# EAGLE design 14140^8 (EAGLE 7.6.0)
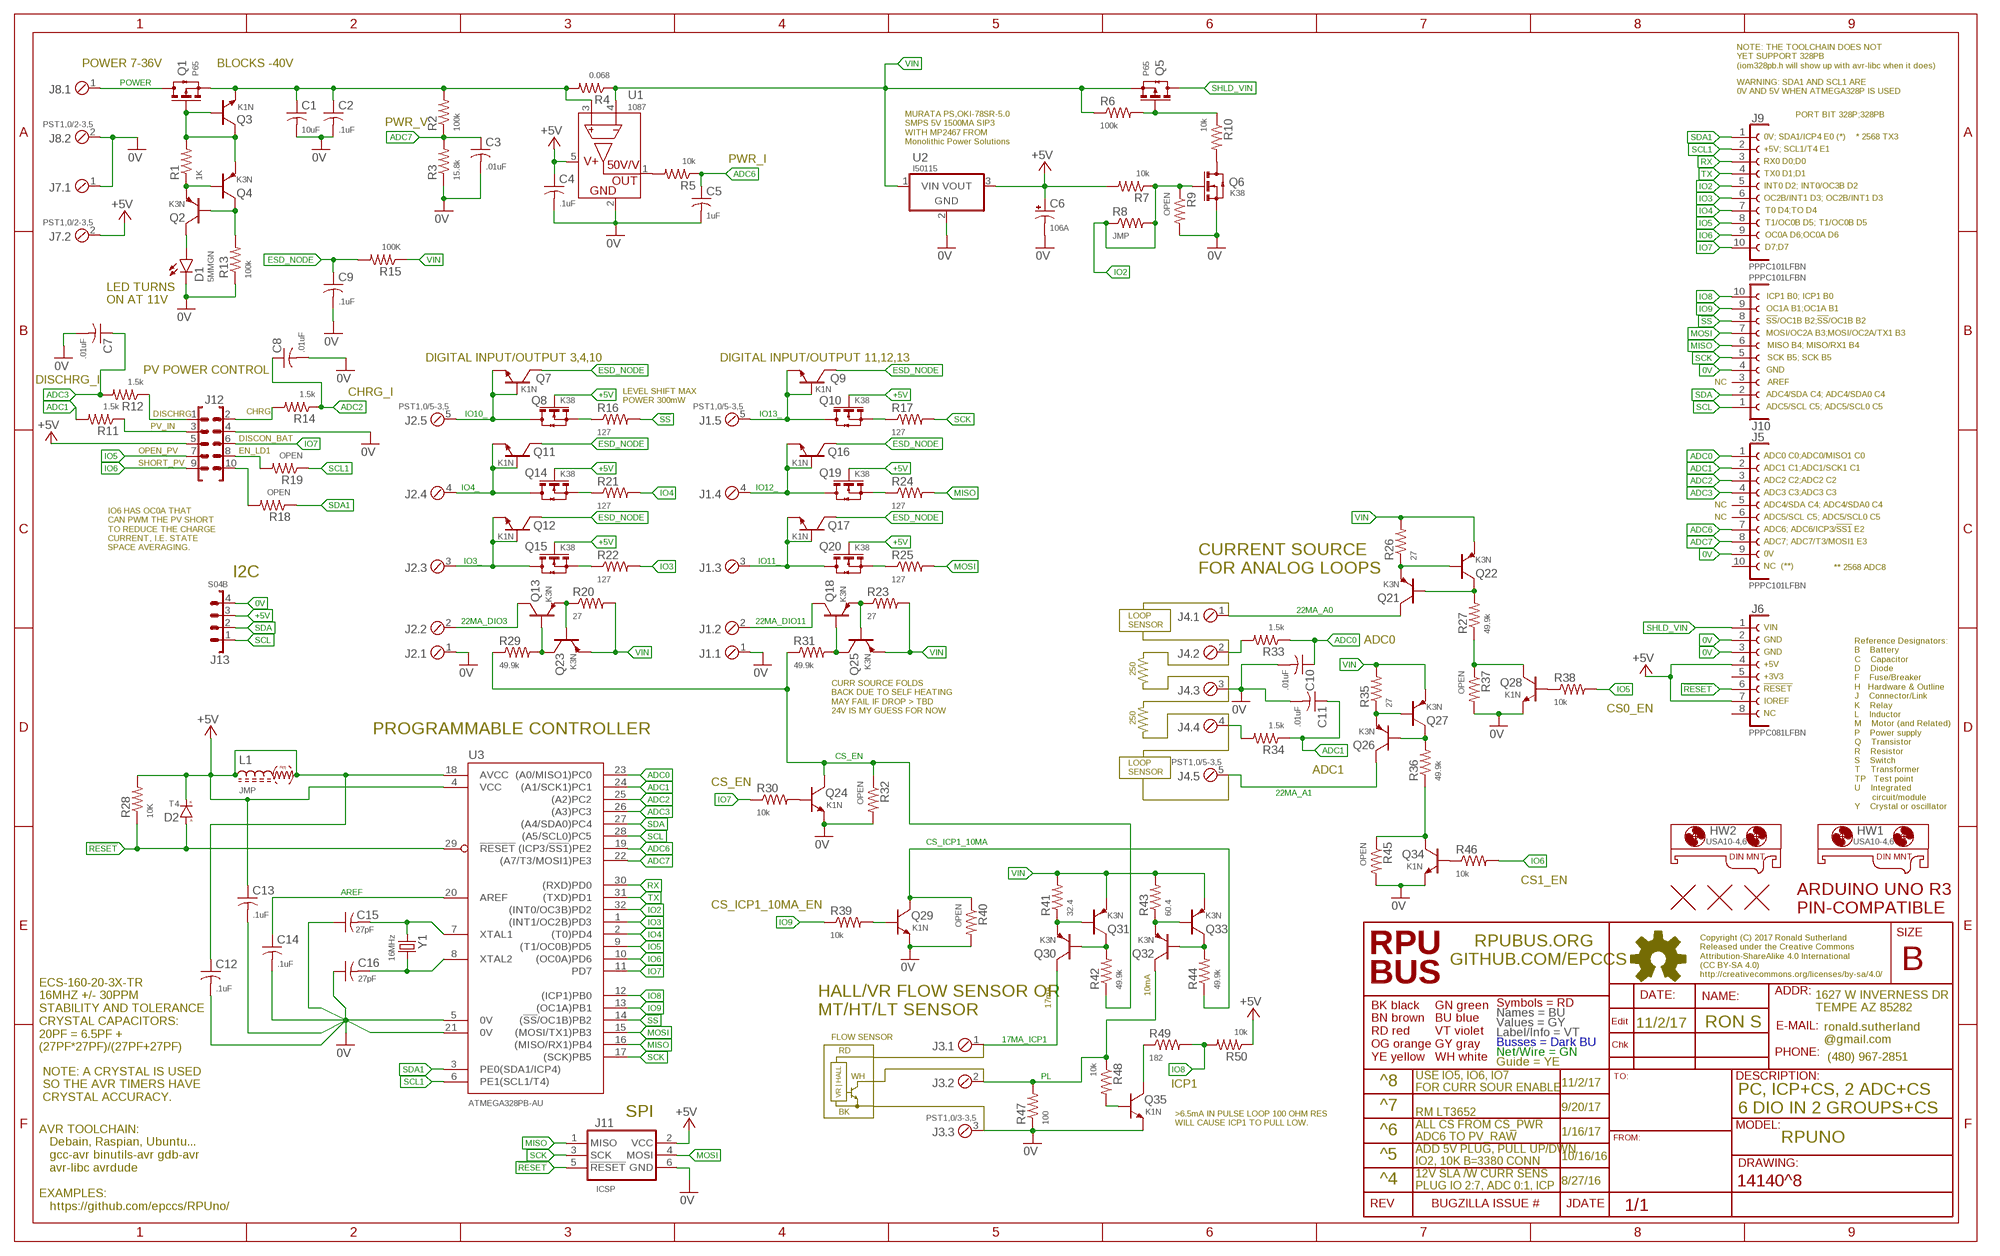
[diagram p0: schematic, sheet 1]

## Parts
C1  10uF  CC1206  [C1206(3216)]
C2  .1uF  CC0805A  [C0805(2012)]
C3  .01uF  CC0603A  [C0603(1608)]
C4  .1uF  CC0603A  [C0603(1608)]
C5  1uF  CC0805A  [C0805(2012)]
C6  106A  CT1206  [3216]
C7  .01uF  CC0603A  [C0603(1608)]
C8  .01uF  CC0603A  [C0603(1608)]
C9  .1uF  CC0603A  [C0603(1608)]
C10  .01uF  CC0603A  [C0603(1608)]
C11  .01uF  CC0603A  [C0603(1608)]
C12  .1uF  CC0603A  [C0603(1608)]
C13  .1uF  CC0603A  [C0603(1608)]
C14  .1uF  CC0603A  [C0603(1608)]
C15  27pF  CC0603A  [C0603(1608)]
C16  27pF  CC0603A  [C0603(1608)]
D1  5MMGN  LED5MM  [LED5MM]
D2  T4  DSOD123  [SOD123]
HW1  USA10-4,6  MOUNT-HOLE5.0  [USA10]
HW2  USA10-4,6  MOUNT-HOLE5.0  [USA10]
J1  PST1,0/5-3,5  MCV5  [MCV5]
J2  PST1,0/5-3,5  MCV5  [MCV5]
J3  PST1,0/3-3,5  MCV3  [MCV3]
J4  PST1,0/5-3,5  MCV5  [MCV5]
J5  PPPC101LFBN  F1X10  [F1X10]
J6  PPPC081LFBN  F1X8  [F1X8]
J7  PST1,0/2-3,5  MCV2  [MCV2]
J8  PST1,0/2-3,5  MCV2  [MCV2]
J9  PPPC101LFBN  F1X10  [F1X10]
J10  PPPC101LFBN  F1X10  [F1X10]
J11  ICSP  ISP-SPIPTH  [ISP]
J12  2X5  [2X5]
J13  S04B  B04B  [B04B]
L1  JMP  L0805  [C0805(2012)]
Q1  P65  N-CHSOT23  [SOT23]
Q2  K3N  PNPSOT23  [SOT23]
Q3  K1N  NPNSOT23  [SOT23]
Q4  K3N  PNPSOT23  [SOT23]
Q5  P65  N-CHSOT23  [SOT23]
Q6  K38  N-CHSOT23  [SOT23]
Q7  K1N  NPNSOT23  [SOT23]
Q8  K38  N-CHSOT23  [SOT23]
Q9  K1N  NPNSOT23  [SOT23]
Q10  K38  N-CHSOT23  [SOT23]
Q11  K1N  NPNSOT23  [SOT23]
Q12  K1N  NPNSOT23  [SOT23]
Q13  K3N  PNPSOT23  [SOT23]
Q14  K38  N-CHSOT23  [SOT23]
Q15  K38  N-CHSOT23  [SOT23]
Q16  K1N  NPNSOT23  [SOT23]
Q17  K1N  NPNSOT23  [SOT23]
Q18  K3N  PNPSOT23  [SOT23]
Q19  K38  N-CHSOT23  [SOT23]
Q20  K38  N-CHSOT23  [SOT23]
Q21  K3N  PNPSOT23  [SOT23]
Q22  K3N  PNPSOT23  [SOT23]
Q23  K3N  PNPSOT23  [SOT23]
Q24  K1N  NPNSOT23  [SOT23]
Q25  K3N  PNPSOT23  [SOT23]
Q26  K3N  PNPSOT23  [SOT23]
Q27  K3N  PNPSOT23  [SOT23]
Q28  K1N  NPNSOT23  [SOT23]
Q29  K1N  NPNSOT23  [SOT23]
Q30  K3N  PNPSOT23  [SOT23]
Q31  K3N  PNPSOT23  [SOT23]
Q32  K3N  PNPSOT23  [SOT23]
Q33  K3N  PNPSOT23  [SOT23]
Q34  K1N  NPNSOT23  [SOT23]
Q35  K1N  NPNSOT23  [SOT23]
R1  1K  R0805  [C0805(2012)]
R2  100k  R0805  [C0805(2012)]
R3  15.8k  R0805  [C0805(2012)]
R4  0.068  R1210  [C1210(3225)]
R5  10k  R0805  [C0805(2012)]
R6  100k  R0805  [C0805(2012)]
R7  10k  R0805  [C0805(2012)]
R8  JMP  R0805  [C0805(2012)]
R9  OPEN  R0805  [C0805(2012)]
R10  10k  R0805  [C0805(2012)]
R11  1.5k  R0805  [C0805(2012)]
R12  1.5k  R0805  [C0805(2012)]
R13  100k  R0805  [C0805(2012)]
R14  1.5k  R0805  [C0805(2012)]
R15  100K  R0805  [C0805(2012)]
R16  127  R0805  [C0805(2012)]
R17  127  R0805  [C0805(2012)]
R18  OPEN  R0805  [C0805(2012)]
R19  OPEN  R0805  [C0805(2012)]
R20  27  R0805  [C0805(2012)]
R21  127  R0805  [C0805(2012)]
R22  127  R0805  [C0805(2012)]
R23  27  R0805  [C0805(2012)]
R24  127  R0805  [C0805(2012)]
R25  127  R0805  [C0805(2012)]
R26  27  R0805  [C0805(2012)]
R27  49.9k  R0805  [C0805(2012)]
R28  10K  R0805  [C0805(2012)]
R29  49.9k  R0805  [C0805(2012)]
R30  10k  R0805  [C0805(2012)]
R31  49.9k  R0805  [C0805(2012)]
R32  OPEN  R0805  [C0805(2012)]
R33  1.5k  R0805  [C0805(2012)]
R34  1.5k  R0805  [C0805(2012)]
R35  27  R0805  [C0805(2012)]
R36  49.9k  R0805  [C0805(2012)]
R37  OPEN  R0805  [C0805(2012)]
R38  10k  R0805  [C0805(2012)]
R39  10k  R0805  [C0805(2012)]
R40  OPEN  R0805  [C0805(2012)]
R41  32.4  R0805  [C0805(2012)]
R42  49.9k  R0805  [C0805(2012)]
R43  60.4  R0805  [C0805(2012)]
R44  49.9k  R0805  [C0805(2012)]
R45  OPEN  R0805  [C0805(2012)]
R46  10k  R0805  [C0805(2012)]
R47  100  R0805  [C0805(2012)]
R48  10k  R0805  [C0805(2012)]
R49  182  R0805  [C0805(2012)]
R50  10k  R0805  [C0805(2012)]
U1  1087  ZXCT1087  [SOT23-5]
U2  I50115  OKI-78SR-H  [OKI-78SR-H]
U3  ATMEGA328PB-AU  [TQFP32-08]
U$1  ARDUINO-UNO  [ARDUINO_UNO]
U$2  FIDUCIAL1.27  [FIDUCIAL-1.27]
U$3  FIDUCIAL1.27  [FIDUCIAL-1.27]
U$4  FIDUCIAL1.27  [FIDUCIAL-1.27]
Y1  16MHz  CSM-3X  [CSM-3X]

## Nets
0V: C1.2 C2.2 C3.2 C4.2 C5.2 C6.- C7.2 C8.2 C9.2 C10.2 C11.2 C12.2 C13.2 C14.2 C15.1 C16.1 D1.K J1.1 J2.1 J3.3 J4.3 J5.9 J6.2 J6.3 J7.1 J8.2 J10.4 J11.6(GND) J12.4 J13.4 Q6.2(S)(S) Q24.E Q28.E Q29.E Q34.E Q35.E R3.1 R9.2 R13.1 R32.2 R37.2 R40.2 R45.2 R47.1 U1.2(GND) U2.2(GND) U3.5(0V) U3.21(0V)
17MA_ICP1: J3.1 Q30.C
22MA_A0: J4.1 Q21.C
22MA_A1: J4.5 Q26.C
22MA_DIO3: J2.2 Q13.C
22MA_DIO11: J1.2 Q18.C
!RESET!: D2.A J6.6 J11.5(!RESET) R28.1 U3.29(!RESET)
!SS: J10.8 R16.2 U3.14((!SS!/OC1B)PB2)
+5V: C4.1 C6.+ C12.1 C13.1 D2.C(K) J6.4 J6.7 J7.2 J11.2(VCC) J12.5 J13.3 L1.1 L1.2 Q8.1(G)(G) Q10.1(G)(G) Q14.1(G)(G) Q15.1(G)(G) Q19.1(G)(G) Q20.1(G)(G) R7.2 R28.2 R50.1 U1.5(VCC) U2.3(VOUT) U3.4(VCC) U3.18(AVCC)
ADC0: C10.1 J5.1 R33.1 U3.23((A0/MISO1)PC0)
ADC1: C11.1 J5.2 R11.2 R34.1 U3.24((A1/SCK1)PC1)
ADC2: C8.1 J5.3 R14.1 U3.25((A2)PC2)
ADC3: C7.1 J5.4 R12.2 U3.26((A3)PC3)
ADC6: C5.1 J5.7 R5.1 U3.19((ICP3/!SS1!)PE2)
ADC7: C3.1 J5.8 R2.1 R3.2 U3.22((A7/T3/MOSI1)PE3)
AREF: C14.1 U3.20(AREF)
CS_EN: Q24.C R29.1 R31.1 R32.1 R42.1
CS_ICP1_10MA: Q29.C R40.1 R44.1
EN_LD1: J12.8 R19.2
ESD_NODE: C9.1 Q7.C Q9.C Q11.C Q12.C Q16.C Q17.C R15.2
IO2: J9.5 Q6.1(G)(G) R7.1 R8.1 R8.2 R9.1 U3.32((INT0/OC3B)PD2)
IO3: J9.6 R22.2 U3.1((INT1/OC2B)PD3)
IO3_: J2.3 Q12.B Q12.E Q15.3(D)(D)
IO4: J9.7 R21.2 U3.2((T0)PD4)
IO4_: J2.4 Q11.B Q11.E Q14.3(D)(D)
IO5: J9.8 J12.7 R38.2 U3.9((T1/OC0B)PD5)
IO6: J9.9 J12.9 R46.2 U3.10((OC0A)PD6)
IO7: J9.10 J12.6 R30.1 U3.11(PD7)
IO8: J10.10 R49.2 R50.2 U3.12((ICP1)PB0)
IO9: J10.9 R39.1 U3.13((OC1A)PB1)
IO10_: J2.5 Q7.B Q7.E Q8.3(D)(D)
IO11_: J1.3 Q17.B Q17.E Q20.3(D)(D)
IO12_: J1.4 Q16.B Q16.E Q19.3(D)(D)
IO13_: J1.5 Q9.B Q9.E Q10.3(D)(D)
MISO: J10.6 J11.1(MISO) R24.2 U3.16((MISO/RX1)PB4)
MOSI: J10.7 J11.4(MOSI) R25.2 U3.15((MOSI/TX1)PB3)
N$1: Q19.2(S)(S) R24.1
N$2: Q5.1(G)(G) R6.2 R10.1
N$3: Q10.2(S)(S) R17.1
N$4: Q6.3(D)(D) R10.2
N$5: Q2.B Q4.C R13.2
N$6: Q1.1(G)(G) Q3.B Q3.C Q4.E R1.2
N$7: D1.A Q2.C
N$8: R5.2 U1.1(OUT)
N$9: Q18.E Q25.B R23.1
N$10: Q2.E Q4.B R1.1
N$11: Q18.B Q25.C R31.2
N$12: Q20.2(S)(S) R25.1
N$13: J12.10 R18.2
N$14: J12.2 R14.2
N$15: J12.1 R12.1
N$16: J12.3 R11.1
N$17: Q29.B R39.2
N$18: Q24.B R30.2
N$19: Q34.C R36.1 R45.1
N$20: Q21.E Q22.B R26.1
N$21: Q28.C R27.1 R37.1
N$22: Q28.B R38.1
N$23: Q21.B Q22.C R27.2
N$24: J4.2 R33.2
N$25: Q34.B R46.1
N$27: J4.4 R34.2
N$28: Q26.E Q27.B R35.1
N$29: Q26.B Q27.C R36.2
N$91: Q13.E Q23.B R20.1
N$93: Q14.2(S)(S) R21.1
N$97: Q13.B Q23.C R29.2
N$104: Q8.2(S)(S) R16.1
N$107: Q35.B R48.2
N$108: Q35.C R49.1
N$110: Q15.2(S)(S) R22.1
N$114: Q30.E Q31.B R41.1
N$115: C15.2 U3.7(XTAL1) Y1.1
N$116: C16.2 U3.8(XTAL2) Y1.2
N$119: Q30.B Q31.C R42.2
N$122: Q32.E Q33.B R43.1
N$123: Q32.B Q33.C R44.2
PL: J3.2 Q32.C R47.2 R48.1
POWER: J8.1 Q1.3(D)(D)
RX: J9.3 U3.30((RXD)PD0)
SCK: J10.5 J11.3(SCK) R17.2 U3.17((SCK)PB5)
SCL: J10.1 J13.1 U3.28((A5/SCL0)PC5)
SCL1: J9.2 R19.1 U3.6(PE1(SCL1/T4))
SDA: J10.2 J13.2 U3.27((A4/SDA0)PC4)
SDA1: J9.1 R18.1 U3.3(PE0(SDA1/ICP4))
SHLD_VIN: J6.1 Q5.3(D)(D)
TX: J9.4 U3.31((TXD)PD1)
VIN: Q5.2(S)(S) Q22.E Q23.E Q25.E Q27.E Q31.E Q33.E R4.1 R6.1 R15.1 R20.2 R23.2 R26.2 R35.2 R41.2 R43.2 U1.4(S-) U2.1(VIN)
VIN_S: C1.1 C2.1 Q1.2(S)(S) Q3.E R2.2 R4.2 U1.3(S+)
Unconnected: J5.5 J5.6 J5.10 J6.5 J6.8 J10.3

## Notes on the sheet
- POWER 7-36V | BLOCKS -40V
- NOTE: THE TOOLCHAIN DOES NOT 
  YET SUPPORT 328PB
  (iom328pb.h will show up with avr-libc when it does)
- WARNING: SDA1 AND SCL1 ARE 
  0V AND 5V WHEN ATMEGA328P IS USED
- PORT BIT 328P;328PB
- PWR_V
- 0V; SDA1/ICP4 E0 (*) | * 2568 TX3
- MURATA PS,OKI-78SR-5.0
  SMPS 5V 1500MA SIP3
  WITH MP2467 FROM 
  Monolithic Power Solutions
- +5V; SCL1/T4 E1
- PWR_I | RX0 D0;D0
- TX0 D1;D1
- INT0 D2; INT0/OC3B D2
- OC2B/INT1 D3; OC2B/INT1 D3
- T0 D4;TO D4
- T1/OC0B D5; T1/OC0B D5
- OC0A D6;OC0A D6
- D7;D7
- ICP1 B0; ICP1 B0
- LED TURNS 
  ON AT 11V
- OC1A B1;OC1A B1
- !SS!/OC1B B2;!SS!/OC1B B2
- MOSI/OC2A B3;MOSI/OC2A/TX1 B3
- MISO B4; MISO/RX1 B4
- DIGITAL INPUT/OUTPUT 3,4,10 | DIGITAL INPUT/OUTPUT 11,12,13 | SCK B5; SCK B5
- PV POWER CONTROL | GND
- DISCHRG_I | NC | AREF
- CHRG_I | ADC4/SDA C4; ADC4/SDA0 C4
- LEVEL SHIFT MAX 
  POWER 300mW
- ADC5/SCL C5; ADC5/SCL0 C5
- CHRG
- DISCHRG
- PV_IN
- DISCON_BAT
- OPEN_PV | EN_LD1
- ADC0 C0;ADC0/MISO1 C0
- SHORT_PV
- ADC1 C1;ADC1/SCK1 C1
- ADC2 C2;ADC2 C2
- ADC3 C3;ADC3 C3
- NC | ADC4/SDA C4; ADC4/SDA0 C4
- NC | ADC5/SCL C5; ADC5/SCL0 C5
- ADC6; ADC6/ICP3/!SS1! E2
- ADC7; ADC7/T3/MOSI1 E3
- IO6 HAS OC0A THAT 
  CAN PWM THE PV SHORT 
  TO REDUCE THE CHARGE 
  CURRENT, I.E. STATE 
  SPACE AVERAGING.
- 0V
- NC  (**) | ** 2568 ADC8
- CURRENT SOURCE
  FOR ANALOG LOOPS
- I2C
- LOOP 
  SENSOR
- VIN
- ADC0 | GND
- GND
- +5V
- 250
- +3V3
- !RESET
- IOREF
- CS0_EN
- CURR SOURCE FOLDS 
  BACK DUE TO SELF HEATING 
  MAY FAIL IF DROP > TBD 
  24V IS MY GUESS FOR NOW
- NC
- 250
- PROGRAMMABLE CONTROLLER
- ADC1
- LOOP 
  SENSOR
- CS_EN
- CS1_EN
- CS_ICP1_10MA_EN
- 10mA
- 17mA
- HALL/VR FLOW SENSOR OR
  MT/HT/LT SENSOR
- 11/2/17 | RON S
- FLOW SENSOR
- ECS-160-20-3X-TR
  16MHZ +/- 30PPM
  STABILITY AND TOLERANCE
  CRYSTAL CAPACITORS:
  20PF = 6.5PF +
  (27PF*27PF)/(27PF+27PF)
- RD
- WH
- ICP1 | ^8 | 11/2/17
- USE IO5, IO6, IO7
  FOR CURR SOUR ENABLE
- VR | HALL
- NOTE: A CRYSTAL IS USED 
  SO THE AVR TIMERS HAVE 
  CRYSTAL ACCURACY.
- ^7 | 9/20/17
- PC, ICP+CS, 2 ADC+CS
  6 DIO IN 2 GROUPS+CS
- SPI | BK | RM LT3652
- >6.5mA IN PULSE LOOP 100 OHM RES
  WILL CAUSE ICP1 TO PULL LOW.
- ^6 | 1/16/17
- ALL CS FROM CS_PWR
  ADC6 TO PV_RAW
- RPUNO
- ^5 | 10/16/16
- ADD 5V PLUG, PULL UP/DWN 
  IO2, 10K B=3380 CONN
- ^4 | 8/27/16
- 12V SLA /W CURR SENS
  PLUG IO 2:7, ADC 0:1, ICP
- AVR TOOLCHAIN: 
     Debain, Raspian, Ubuntu...
     gcc-avr binutils-avr gdb-avr 
     avr-libc avrdude
  
  EXAMPLES:
     https://github.com/epccs/RPUno/

## Library data of the parts
C1-C5 C7-C16 = C-C:C: CAPACITOR Symbol
C6 = C-T:CT: Tantalum Electrolytic Capacitor
D1 = D-LED:LED: LED 120120WH [CREE,XHGAWT-00-0000-00000HXE1] LED WHITE 6500K 150LUM-W120120
D2 = D-GP:D: DIODE
HW1 HW2 = HW-DINMnt:MOUNT-HOLE: USA10-4.6 [PhxCont,1202713] DINRAIL ADAPTER UNIVERSAL 10MM 4.6MM
J1 J2 J4 = J-HDR3.5mm:MCV5: MCV 1,5/5-G-3,5-RN [PHOENIX CONTACT,1843635] CONN HEADER SHROUDED 5POS 3.5MM MCVR 1,5/5-ST-3,5 [PHOENIX CONTACT,1863181] CONN PLUG 5POS SCREW 3.5MM PST 1,0/5-3,5 [PHOENIX CONTACT,1945122] CONN HEADER STRIP PIN 5POS 3.5MM PT 1,5/5-PVH-3,5 [PHOENIX CONTACT,1984044] CONN PLUG STRIP 4POS 3.5MM Drill Size 3/64": .0469" (1.2mm)
J3 = J-HDR3.5mm:MCV3: MCV 1,5/ 3-G-3,5-RN [PHOENIX CONTACT,1731484] CONN HEADER SHROUDED 3POS 3.5MM MCVR 1,5/ 3-ST-3,5 [PHOENIX CONTACT,1863165] CONN PLUG 3POS SCREW 3.5MM PST 1,0/3-3,5 [PHOENIX CONTACT,1945106] CONN HEADER STRIP PIN 3POS 3.5MM PT1,5&3-PVH-3,5 [PHOENIX CONTACT,1984028] CONN PLUG STRIP 3POS 3.5MM
J5 J9 J10 = J-HDR2.54mm:F1X10: FEMALE HEADER 10POS
J6 = J-HDR2.54mm:F1X8: FEMALE HEADER 8POS
J7 J8 = J-HDR3.5mm:MCV2: MCV 1,5/ 2-G-3,5-RN [PHOENIX CONTACT,1731471] CONN HEADER SHROUDED 2POS 3.5MM MCVR 1,5/ 2-ST-3,5 [PHOENIX CONTACT,1863152] CONN PLUG 2POS SCREW 3.5MM PST 1,0/2-3,5 [PHOENIX CONTACT,1945096] CONN HEADER STRIP PIN 2POS 3.5MM PT1,5/2-PVH-3,5 [PHOENIX CONTACT,1984015] CONN PLUG STRIP 2POS 3.5MM
J11 = U-AVR:ISP-SPI: AVR ISP thru SPI In-System Programming uses the target Atmel AVR’s internal SPI (Serial Peripheral Interface) to download code into the flash and EEPROM memories. It is not a debugging interface. When designing an application PCB which includes an AVR with the SPI interface, this pinout should be used. Sparkfun SKU: BOB-08508
J12 = J-HDR2.54mm:2X5: 2 X 5 POS HEADER
J13 = J-HDR2mm:B04B: B04B [JST@B04B-PASK] CONN HEADER VERT THRU 4POS S04B [JST@S04B-PASK] CONN HEADER SIDE THRU 4POS
L1 = L-FB:L: Ferrite Bead with frequency dependent resistance
Q1 Q5 = Q-PCH:N-CH?*: ENHANCEMENT MODE MOSFET SOT23 is BSS138 pinout
Q2 Q4 Q13 Q18 Q21-Q23 Q25-Q27 Q30-Q33 = Q-PNP:PNP: BJT NPN General Purpose Amplifier
Q3 Q7 Q9 Q11 Q12 Q16 Q17 Q24 Q28 Q29 Q34 Q35 = Q-NPN:NPN: BJT NPN General Purpose Amplifier
Q6 Q8 Q10 Q14 Q15 Q19 Q20 = Q-NCH:N-CH?*: ENHANCEMENT MODE MOSFET SOT23 is BSS138 pinout
R1-R50 = R-C:R: Resiistor American-style symbol
U1 = U-Linear:ZXCT1087: 1087 [DIODES,ZXCT1087E5TA] HISIDE CURRENT MONITOR SOT23-5
U2 = P-DCDC:OKI-78SR: OKI-78SR OKI-78SR-5/1.5-W36H-C 5V@1.5A Horizontal Mount OKI-78SR-5/1.5-W36-C 5V@1.5A Vert Mount OKI-78SR-3.3/1.5-W36H-C 3.3V@1.5A Horizontal Mount OKI-78SR-3.3/1.5-W36-C 3.3V@1.5A Vert Mount Murata Power Solutions 7 to 36 VDC input range need to verify pinout
U3 = U-AVR:ATMEGA328PB-AU: ATmega328PB 4 Kbytes FLASH 128 bytes SRAM 256 bytes EEPROM 2 UART, 2 I2C, 2 SPI 8-channel 10 bit ADC
U$1 = J-BoardHDR:ARDUINO-UNO: Board Outline with holes and silk note the board dim layer is not defined
U$2-U$4 = H-Fiducial:FIDUCIAL: Fiducial Alignment Points Various fiducial points for machine vision alignment.
Y1 = Y-XTL:CSM: 16MHZ20 [ECS,ECS-160-20-3X-TR] CRYSTAL 16MHZ 20PF 30PPM CSM-3X

## Net classes
0 default: width 0.178 mm, drill 0.33 mm

## Board
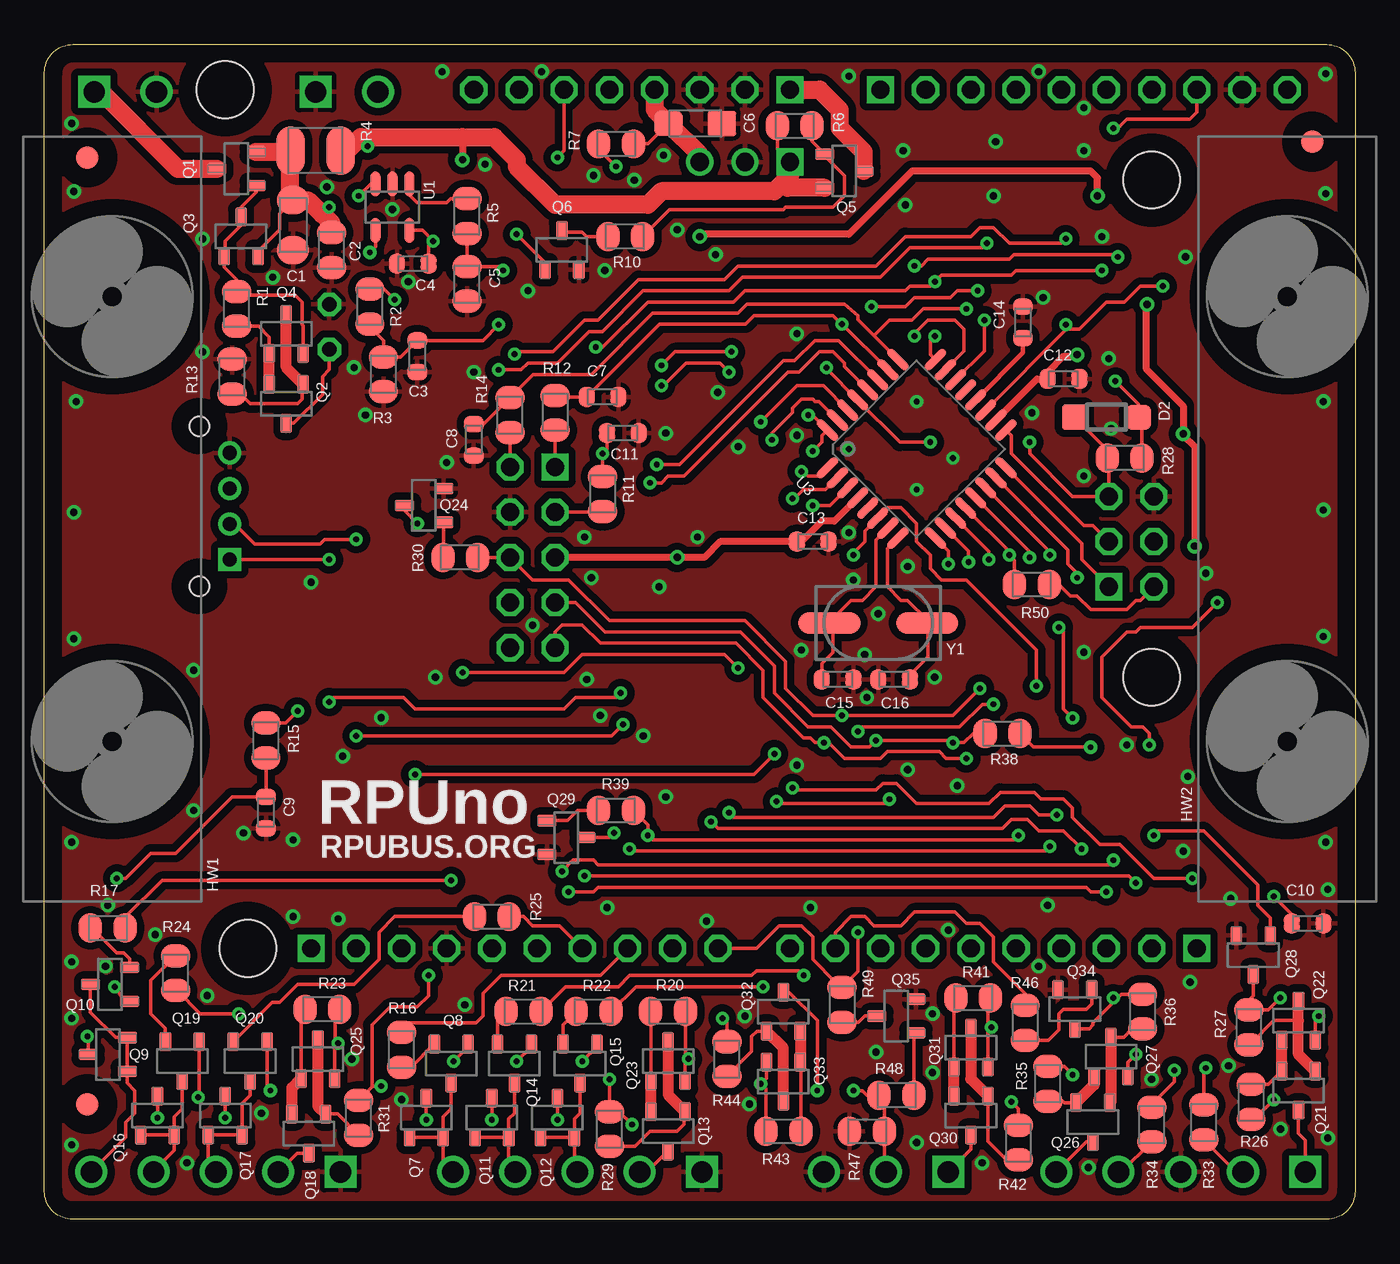
[diagram p1: board, top side]
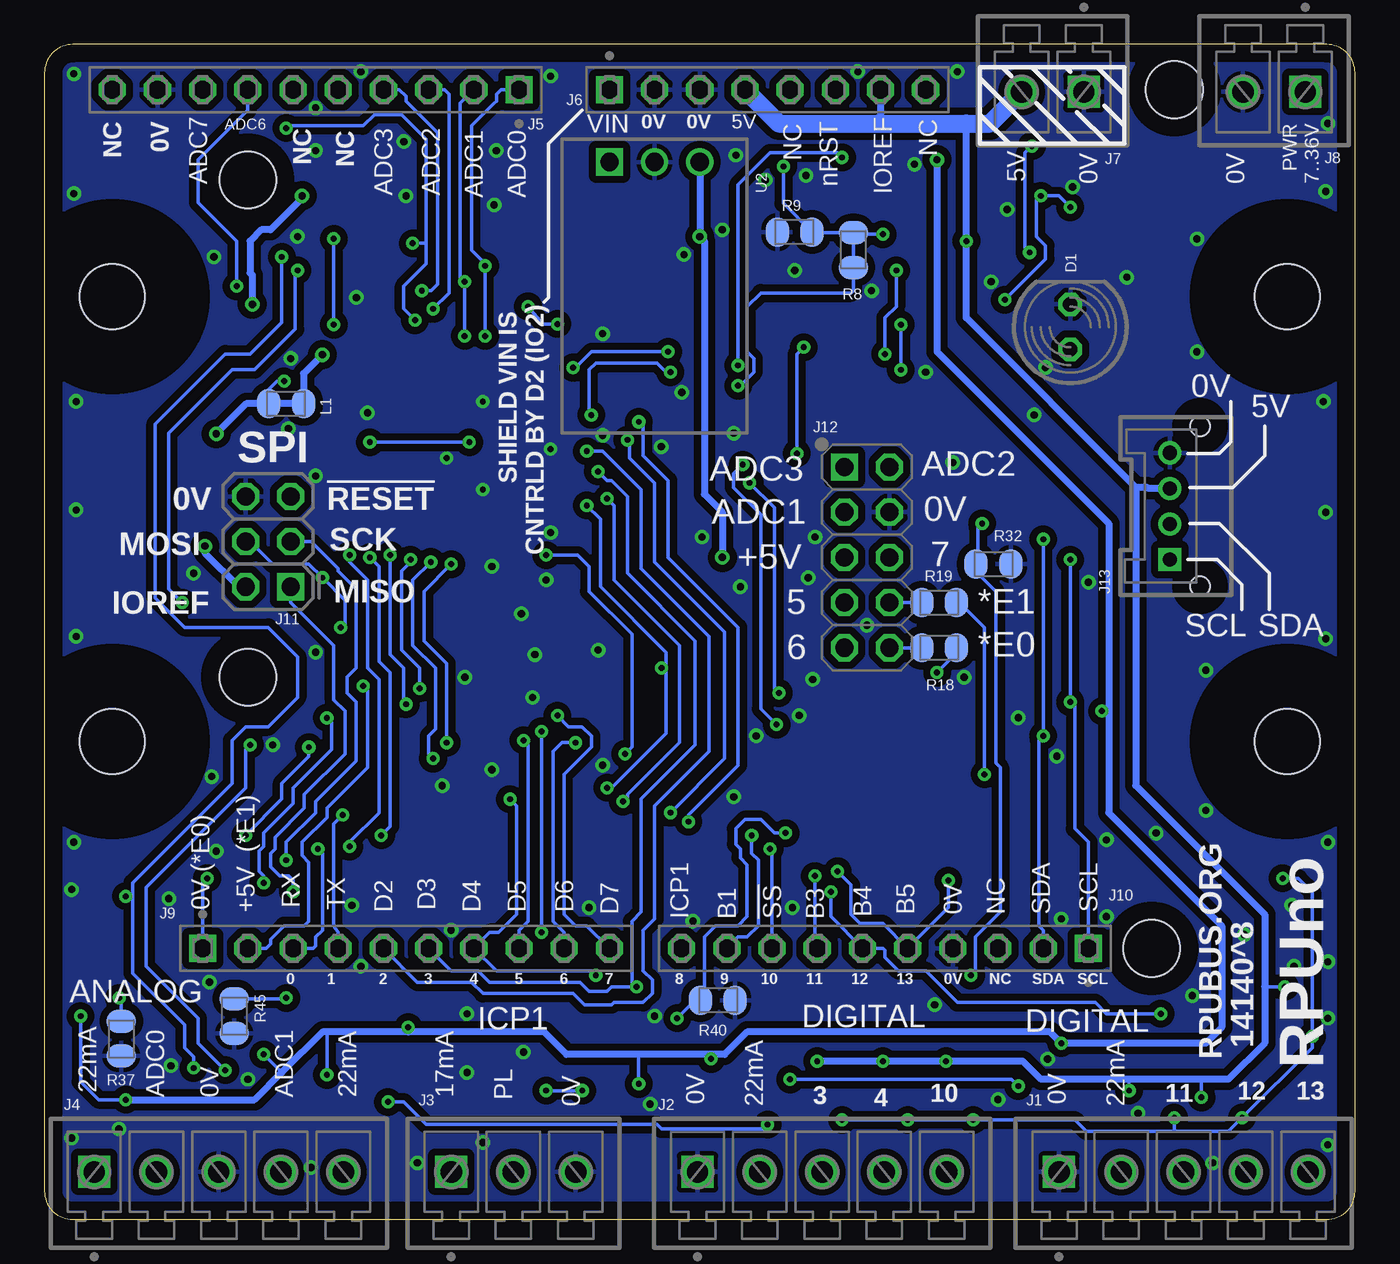
[diagram p2: board, bottom side, seen from below]

Size 73.66 x 66.04 mm. Coordinates in mm from the lower left corner, seen from the top.
Outline: 73.66,64.45 73.66,1.59 arc-90 72.07,0 1.59,0 arc-90 0,1.59 0,64.45 arc-90 1.59,66.04 72.07,66.04 arc-90 73.66,64.45
Copper layers (1*16): Top 0.034290625mm / dielectric 60mil / Bottom 0.034290625mm
Design rules "default *": minimum track width 7mil, minimum drill 13mil, track to track 12mil, track to pad 10mil, pad to pad 8mil, via to via 12mil, smd to smd 8mil, copper to edge 40mil, drill to drill 16mil, minimum pad ring 10mil, minimum via ring 8mil, stop-mask expansion 4mil, vias tented up to drill 17mil, thermal gap 10mil
Holes 3.2 mm at 10.16,63.5 11.43,15.24 62.23,30.48 62.23,58.42

### Footprints (pad centres in the part's own frame; a part is rotated, then mirrored left to right if it is on the bottom)
C1206(3216) = smd 1.6 x 1.8: 1 -1.4,0; 2 1.4,0
C0805(2012) = smd 1.321 x 1.651: 1 -0.977,0; 2 0.977,0
C0603(1608) = smd 0.898 x 1.1: 1 -0.889,0; 2 0.889,0
3216 = smd 1.6 x 1.4: + -1.5,0; - 1.5,0
LED5MM = drill 0.813 octagon: A -1.27,0; K 1.27,0
SOD123 = smd 1.4 x 1.4: A 1.8,0; C -1.8,0
USA10 = hole 3.658: -12.5,0; 12.5,0
MCV5 = drill 1.2 square: 1 0,0 | drill 1.2: 2 3.5,0; 3 7,0; 4 10.5,0; 5 14,0
MCV3 = drill 1.2 square: 1 0,0 | drill 1.2: 2 3.5,0; 3 7,0
F1X10 = drill 1.016 square: 1 0,0 | drill 1.016 octagon: 2 2.54,0; 3 5.08,0; 4 7.62,0; 5 10.16,0; 6 12.7,0; 7 15.24,0; 8 17.78,0; 9 20.32,0; 10 22.86,0
F1X8 = drill 1.016 square: 1 0,0 | drill 1.016 octagon: 2 2.54,0; 3 5.08,0; 4 7.62,0; 5 10.16,0; 6 12.7,0; 7 15.24,0; 8 17.78,0
MCV2 = drill 1.2 square: 1 0,0 | drill 1.2: 2 3.5,0
ISP = drill 1.016 square: 1 0,0 | drill 1.016 octagon: 2 0,2.54; 3 2.54,0; 4 2.54,2.54; 5 5.08,0; 6 5.08,2.54
2X5 = drill 1.016 square: 1 0,0 | drill 1.016 octagon: 2 0,2.54; 3 2.54,0; 4 2.54,2.54; 5 5.08,0; 6 5.08,2.54; 7 7.62,0; 8 7.62,2.54; 9 10.16,0; 10 10.16,2.54
B04B = drill 0.8 square: 1 0,0 | drill 0.8: 2 2,0; 3 4,0; 4 6,0 | hole 1.1: 7.5,-1.7; -1.5,-1.7
SOT23 = smd 0.65 x 1.06: 1(G) -0.95,-1.1; 2(S) 0.95,-1.1; 3(D) 0,1.1
SOT23' = smd 0.65 x 1.06: B -0.95,-1.1; C 0,1.1; E 0.95,-1.1
C1210(3225) = smd 1.6 x 2.7: 1 -1.4,0; 2 1.4,0
SOT23-5 = smd 0.55 x 1.4: 1 -0.95,-1.3; 2 0,-1.3; 3 0.95,-1.3; 4 0.95,1.3; 5 -0.95,1.3
OKI-78SR-H = drill 1.016 square: 1 0,0 | drill 1.016: 2 -2.54,0; 3 -5.08,0
TQFP32-08 = smd 1.5 x 0.45: 1 -4.293,2.8; 2 -4.293,2; 3 -4.293,1.2; 4 -4.293,0.4; 5 -4.293,-0.4; 6 -4.293,-1.2; 7 -4.293,-2; 8 -4.293,-2.8; 17 4.293,-2.8; 18 4.293,-2; 19 4.293,-1.2; 20 4.293,-0.4; 21 4.293,0.4; 22 4.293,1.2; 23 4.293,2; 24 4.293,2.8 | smd 0.45 x 1.5: 9 -2.8,-4.293; 10 -2,-4.293; 11 -1.2,-4.293; 12 -0.4,-4.293; 13 0.4,-4.293; 14 1.2,-4.293; 15 2,-4.293; 16 2.8,-4.293; 25 2.8,4.293; 26 2,4.293; 27 1.2,4.293; 28 0.4,4.293; 29 -0.4,4.293; 30 -1.2,4.293; 31 -2,4.293; 32 -2.8,4.293
FIDUCIAL-1.27 = smd 1.27 x 1.27: 1 0,0
CSM-3X = smd 3.5 x 1.2: 1 -2.75,0; 2 2.75,0

### Placement (x,y rotation side)
C1  13.97,55.88 270 top
C2  16.13,54.48 270 top
C3  20.95,48.51 270 top
C4  20.7,53.72 180 top
C5  23.75,52.58 270 top
C6  36.58,61.59 0 top
C7  31.37,46.23 0 top
C8  24.13,43.81 270 top
C9  12.45,22.86 270 top
C10  70.99,16.64 0 top
C11  32.51,44.2 0 top
C12  57.28,47.24 0 top
C13  43.18,38.1 0 top
C14  54.99,50.42 90 top
C15  44.58,30.35 180 top
C16  47.75,30.35 0 top
D1  16,50.16 90 bottom
D2  59.69,45.09 180 top
HW1  3.81,39.37 90 top
HW2  69.85,39.37 90 top
J1  16.64,2.67 0 bottom
J2  36.96,2.67 0 bottom
J3  50.8,2.67 0 bottom
J4  70.87,2.67 0 bottom
J5  46.99,63.5 180 bottom
J6  41.91,63.5 0 bottom
J7  15.24,63.37 180 bottom
J8  2.79,63.37 180 bottom
J9  64.77,15.24 0 bottom
J10  14.99,15.24 180 bottom
J11  59.82,35.56 90 bottom
J12  28.7,42.29 270 bottom
J13  10.41,37.08 90 bottom
L1  60.07,45.85 180 bottom
Q1  10.79,59.05 90 top
Q2  K3N  [SOT23']  13.59,45.85 180 top
Q3  K1N  [SOT23']  11.05,55.24 0 top
Q4  K3N  [SOT23']  13.59,49.78 0 top
Q5  44.96,58.93 270 top
Q6  29.08,54.48 0 top
Q7  K1N  [SOT23']  21.46,5.71 0 top
Q8  22.86,8.76 180 top
Q9  K1N  [SOT23']  3.56,9.27 90 top
Q10  3.68,13.21 90 top
Q11  K1N  [SOT23']  25.15,5.71 0 top
Q12  K1N  [SOT23']  28.83,5.71 0 top
Q13  K3N  [SOT23']  35.05,4.95 180 top
Q14  26.42,8.76 180 top
Q15  30.1,8.76 180 top
Q16  K1N  [SOT23']  6.35,5.84 0 top
Q17  K1N  [SOT23']  10.16,5.84 0 top
Q18  K3N  [SOT23']  14.86,4.83 180 top
Q19  7.75,8.89 180 top
Q20  11.56,8.89 180 top
Q21  K3N  [SOT23']  70.48,7.24 180 top
Q22  K3N  [SOT23']  70.48,11.18 0 top
Q23  K3N  [SOT23']  35.05,8.89 0 top
Q24  K1N  [SOT23']  21.34,40.13 90 top
Q25  K3N  [SOT23']  15.37,9.02 0 top
Q26  K3N  [SOT23']  58.93,5.46 180 top
Q27  K3N  [SOT23']  59.94,9.14 0 top
Q28  K1N  [SOT23']  67.94,14.86 180 top
Q29  K1N  [SOT23']  29.34,21.46 270 top
Q30  K3N  [SOT23']  52.07,5.84 180 top
Q31  K3N  [SOT23']  52.07,9.65 0 top
Q32  K3N  [SOT23']  41.53,11.68 0 top
Q33  K3N  [SOT23']  41.53,7.75 180 top
Q34  K1N  [SOT23']  57.91,11.81 180 top
Q35  K1N  [SOT23']  47.88,11.43 90 top
R1  10.79,51.18 90 top
R2  18.29,51.31 90 top
R3  19.05,47.5 90 top
R4  15.24,60.07 180 top
R5  23.75,56.39 90 top
R6  42.16,61.47 0 top
R7  32.13,60.45 0 top
R8  28.19,54.48 90 bottom
R9  31.5,55.5 180 bottom
R10  32.64,55.24 180 top
R11  31.37,40.77 90 top
R12  28.7,45.34 90 top
R13  10.54,47.37 270 top
R14  26.16,45.21 270 top
R15  12.45,26.92 270 top
R16  20.07,9.53 90 top
R17  3.56,16.38 0 top
R18  23.37,32.13 180 bottom
R19  23.37,34.67 180 bottom
R20  35.05,11.68 0 top
R21  26.92,11.68 0 top
R22  30.86,11.68 0 top
R23  15.62,11.81 0 top
R24  7.37,13.84 270 top
R25  25.15,17.02 0 top
R26  67.82,6.6 270 top
R27  67.69,10.79 270 top
R28  60.71,42.8 0 top
R29  31.75,5.08 270 top
R30  23.37,37.21 180 top
R31  17.65,5.71 270 top
R32  20.32,36.83 0 bottom
R33  65.15,5.46 270 top
R34  62.23,5.33 270 top
R35  56.39,7.62 90 top
R36  61.72,11.68 270 top
R37  69.34,10.16 270 bottom
R38  53.85,27.3 180 top
R39  32.13,22.99 180 top
R40  35.81,12.32 0 bottom
R41  52.2,12.45 0 top
R42  54.74,4.32 270 top
R43  41.53,4.95 180 top
R44  38.35,9.02 270 top
R45  62.99,11.43 270 bottom
R46  55.12,11.05 90 top
R47  46.23,4.95 0 top
R48  47.88,6.99 0 top
R49  44.83,12.06 90 top
R50  55.5,35.69 180 top
U1  19.56,56.9 180 top
U2  41.91,59.44 180 bottom
U3  49.02,43.31 45 top
U$1  -3.81,66.04 180 bottom  (outside the outline)
U$2  71.25,60.58 0 top
U$3  2.41,59.69 0 top
U$4  2.41,6.48 0 top
Y1  46.86,33.53 0 top

### Tracks (layer width: path | path; a pad name or v marks a point on that pad's centre or on a via)
0V  (via drill 0.33, 0.41)
  other vias: 64.39,13.34 50.8,16.26 59.82,48.39 56.13,51.82 16.51,16.89 42.29,25.53 48.51,25.27 31.62,17.53 22.35,64.52 31.5,53.34 27.94,64.52 48.39,57.02 64.14,54.1 13.97,17.02 1.52,4.19 45.21,43.31 53.34,57.53 59.44,55.24 37.72,54.23 48.26,60.07 45.21,64.26 35.56,55.63 49.02,41.02 51.05,42.8 49.02,45.97 58.42,60.07 58.42,62.48 55.88,64.52 72.01,64.39 72.01,57.66 71.88,45.97 71.88,39.88 71.88,32.77 64.26,24.89 72.01,21.21 72.14,18.54 66.67,18.03 64.01,20.7 34.8,59.82 30.86,58.67 27.18,52.2 33.15,58.42 48.51,36.7 50.04,30.48 46.1,31.75 46.86,34.04 45.21,38.61 45.47,35.94 36.7,38.35 15.88,58.04 19.56,56.77 20.45,52.7 24.77,59.31 1.52,11.3 17.4,47.88 18.03,45.21 22.61,42.55 12.83,52.96 1.65,57.78 1.52,61.59 8.89,55.12 8.89,48.77 1.78,45.97 1.65,39.75 1.65,32.64 8.38,30.86 8.38,22.99 1.52,21.21 1.52,14.48 11.18,21.72 60.83,26.67 58.42,31.88 65.28,36.32 58.42,41.78 59.94,44.45 55.5,45.34 24.13,47.62 14.99,35.81 16.76,26.04 18.92,28.19 34.54,35.56 30.73,36.07 30.35,38.35 34.92,44.2 37.85,46.48 42.29,49.78 30.48,30.35 21.97,30.48 31.24,28.32 42.55,32 46.23,29.34 38.99,43.43 42.29,44.07 43.05,17.53 37.21,16.76 72.14,4.57 69.47,5.08 66.55,8.64 62.23,7.87 58.67,2.92 52.7,3.17 49.02,4.32 49.91,8.26 49.91,11.56 39.37,11.43 20.07,6.73 12.19,5.97 8,3.17 6.22,16 3.56,17.65 9.14,12.57 46.74,9.4 56.39,17.65 51.31,24.38 34.92,23.75 33.66,27.18 13.97,21.34 55.88,14.22 17.27,9.02 39.62,6.48 3.43,14.22 53.47,60.58 27.43,33.4 23.62,12.06
  pour Bottom (isolate 0.406): 0,66.04 73.66,66.04 73.66,0 0,0
  pour Top (isolate 0.406, rank 6): 0,66.04 73.66,66.04 73.66,0 0,0
17MA_ICP1
  Top 0.203: Q30.C 52.07,3.94 J3.1
22MA_A0
  Top 0.203: Q21.C 70.48,4.83 70.87,4.45 J4.1
22MA_A1
  Top 0.203: Q26.C 58.56,4.36 J4.5
22MA_DIO3
  Top 0.203: J2.2 33.87,2.67 Q13.C
22MA_DIO11
  Top 0.203: Q18.C 14.2,3.73 J1.2
!RESET!  (via drill 0.33)
  Top 0.203: 43.94,47.82 U3.29 48.08,43.69 v49.78,43.69 | v55.37,43.69 55.37,43.05 57.78,40.64 J11.5 59.82,42.84 R28.1 59.73,43.25 D2.A | v38.61,48.77 35.43,48.77 v34.67,48.01 | v28.83,59.69 29.21,60.07 J6.6
  Top 0.254: 43.94,47.82 v43.94,47.88
  Bottom 0.203: 43.81,47.88 42.93,48.77 v38.61,48.77 | v55.37,43.69 v49.78,43.69 | v34.67,48.01 34.67,58.17 32.89,59.94 29.08,59.94 v28.83,59.69
  Bottom 0.254: v43.94,47.88 43.81,47.88
!SS  (via drill 0.33)
  Top 0.203: U3.14 56.52,37.51 v56.52,37.34 | v56.52,20.95 56.26,20.7 33.02,20.7 v32.89,20.83 | J10.8 31.24,13.72 25.65,13.72 24.64,12.7 24.64,11.43 24.26,11.05 20.45,11.05 20.07,10.67 R16.2
  Bottom 0.203: v56.52,37.34 56.52,36.96 55.5,35.94 55.5,30.99 54.86,30.35 54.86,22.86 56.52,21.21 v56.52,20.95 | v32.89,20.83 32.77,20.7 J10.8
+5V  (via drill 0.33, 0.41)
  Top 0.203: R7.2 33.93,60.45 C6.+ | C4.1 21.59,54.74 v21.84,54.99 21.24,55.6 U1.5 | R50.1 57.02,35.69 57.66,35.05 58.04,35.05 58.8,34.29 60.83,34.29 61.34,34.8 61.59,34.8 J11.2 | R28.2 61.68,44.89 D2.C 61.49,45.83 v60.2,47.12 | Q15.1(G) 31.05,9.71 v30.23,8.89 | Q14.1(G) 27.37,9.71 v26.54,8.89 | Q8.1(G) 23.81,9.71 v22.99,8.89 | Q20.1(G) 12.51,7.43 v12.7,7.24 | Q19.1(G) 8.7,6.92 v8.64,6.86 | Q10.1(G) 4.51,12.26 v3.94,13.08
  Top 0.406: v59.18,57.53 59.18,58.55 58.8,58.93 48.77,58.93 45.21,55.37 36.96,55.37 v36.83,55.24 | U3.4 44.39,39.24 43.69,39.24 42.55,38.1 C13.1 37.97,38.1 37.08,37.21 v35.56,37.21 J12.5 | v64.64,37.85 64.64,43.43 64.01,44.07 v64.01,44.16 64.01,45.72 61.94,47.79 61.94,51.4 v61.98,51.44 | U3.18 55.79,47.24 C12.1 56.39,47.62 57.28,48.51 57.95,48.51 v58.04,48.6
  Top 1.016: U2.3 36.83,59.84 C6.+ 34.29,62.38 J6.4
  Bottom 0.203: v12.7,7.24 12.7,7.87 | v8.64,6.86 8.64,7.87 | v60.2,47.12 60.58,47.12 61.05,46.65 L1.2 | v3.94,13.08 5.08,13.08
  Bottom 0.406: v35.56,37.21 35.56,39.75 36.58,40.77 36.58,54.99 v36.83,55.24 U2.3 | v59.18,57.53 59.18,57.4 60.96,55.63 61.47,55.63 62.1,54.99 62.1,53.21 61.98,53.09 v61.98,51.44 | J6.7 26.67,61.72 26.8,61.59 | 21.84,61.59 v21.84,54.99 21.84,50.67 12.32,41.15 | 12.32,41.15 11.68,41.15 11.62,41.08 J13.3 | 12.32,41.15 12.32,24.38 5.08,17.14 5.08,13.08 5.08,9.91 7.11,7.87 8.64,7.87 12.7,7.87 17.65,7.87 18.67,8.89 v22.99,8.89 v26.54,8.89 v30.23,8.89 | v64.64,37.85 64.64,37.47 62.74,35.56 J11.2 | v64.01,44.16 62.32,45.85 L1.2 L1.1 59.09,47.55 v58.04,48.6
  Bottom 1.016: J6.4 32.38,61.59 26.8,61.59 21.84,61.59 20.52,61.59 J7.2
ADC0  (via drill 0.33)
  Top 0.203: U3.23 51.69,48.8 51.69,50.04 51.18,50.55 49.66,50.55 48.9,49.78 v48.9,49.66 | R33.1 65.15,8.38 v65.28,8.51 | v60.33,54.1 60.2,54.23 54.48,54.23 54.23,53.98 49.66,53.98 49.28,53.59 v48.9,53.59 | C10.1 70.1,17.14 v69.09,18.16
  Bottom 0.203: v48.9,49.66 v48.9,53.59 48.9,53.72 49.66,54.48 49.66,60.83 49.66,61.47 48.39,62.74 48.26,62.87 48.26,63.25 48.01,63.5 J5.1 | v65.28,8.51 65.28,9.14 65.79,9.65 65.79,10.92 68.71,13.84 68.71,18.16 | 68.71,18.16 68.71,18.92 63.12,24.51 63.12,26.92 62.36,27.69 61.09,27.69 59.44,29.34 59.44,31.62 61.09,33.27 65.79,33.27 67.44,34.92 67.44,44.7 63.5,48.64 62.1,48.64 60.33,50.42 v60.33,54.1 | v69.09,18.16 68.71,18.16
ADC1  (via drill 0.33)
  Top 0.203: U3.24 49.78,48.62 49.78,49.4 v50.04,49.66 | 62.23,6.48 63.5,7.75 v63.5,8.38 | v59.44,53.34 54.61,53.34 54.36,53.09 50.42,53.09 v50.04,52.7 49.78,52.45 48.64,52.45 48.39,52.2 39.37,52.2 38.73,51.56 33.91,51.56 31.37,49.02 v30.99,49.02 | R11.2 v31.37,43.05 31.62,43.31 C11.1 | v65.91,34.67 64.52,33.27 61.59,33.27 61.34,33.02 60.83,33.02 59.44,31.62 59.44,29.34 61.09,27.69 61.72,27.69 62.1,27.3 v62.1,26.67
  Top 0.254: R34.1 62.23,6.48
  Bottom 0.203: v50.04,49.66 v50.04,52.7 50.29,52.96 50.29,62.74 J5.2 | v63.5,8.38 65.02,9.91 65.02,11.3 67.94,14.22 67.94,18.67 62.36,24.26 62.36,26.42 v62.1,26.67 | v59.44,53.34 59.56,53.21 59.56,50.04 61.85,47.75 63.12,47.75 66.67,44.2 66.67,35.43 v65.91,34.67 | v31.37,43.05 31.37,48.64 v30.99,49.02
ADC2  (via drill 0.33)
  Top 0.203: U3.25 46.62,49.67 | 46.62,49.67 45.72,50.57 45.72,50.8 44.96,51.44 39.5,51.44 38.99,50.93 34.16,50.93 30.73,47.5 27.47,47.5 R14.1 | v51.82,51.18 49.4,51.18 48.77,50.55 47.5,50.55 46.62,49.67 | C8.1 24.68,44.7 R14.1 | 26.2,46.23 R14.1
  Bottom 0.203: v51.82,51.18 50.93,52.07 50.93,63.25 51.18,63.5 J5.3
ADC3  (via drill 0.33)
  Top 0.203: U3.26 v44.83,50.33 44.8,50.33 44.32,50.8 39.88,50.8 39.4,50.33 34.58,50.33 C7.1 28.79,46.23 R12.2 | v46.48,51.31 48.39,51.31 48.9,51.82 50.93,51.82 51.31,52.2 v52.45,52.2
  Bottom 0.203: v44.83,50.33 45.63,50.33 v46.48,51.31 | v52.45,52.2 51.94,52.2 51.56,52.58 51.56,61.09 53.34,62.87 53.34,63.12 53.72,63.5 J5.4
ADC6  (via drill 0.33)
  Top 0.203: U3.19 57.45,50.04 | 57.45,50.04 58.17,50.04 59.69,51.56 60.71,51.56 61.59,52.45 v62.87,52.45 | R5.1 C5.1 25.57,53.55 v25.78,53.34 | v26.42,48.64 26.54,48.77 28.57,48.77 30.35,50.55 31.11,50.55 33.4,52.83 38.23,52.83 38.99,53.59 46.74,53.59 48.39,55.24 52.07,55.24 52.58,55.75 53.34,55.75 54.23,54.86 57.15,54.86 v57.4,55.12 | 57.45,50.04 57.45,50.25 v57.4,50.29
  Bottom 0.203: v62.87,52.45 62.87,54.99 65.02,57.15 65.02,59.56 62.23,62.36 J5.7 | v25.78,53.34 25.78,51.31 26.42,50.67 v26.42,48.64 | v57.4,55.12 v57.4,50.29
ADC7  (via drill 0.33)
  Top 0.203: U3.22 52.83,48.81 v52.83,50.55 | v60.07,61.34 60.33,61.34 60.83,61.85 64.39,61.85 64.77,62.23 J5.8 | R2.1 18.29,50.16 19.05,49.4 R3.2 20.03,48.48 C3.1 24.64,49.4 v25.53,50.29 | v25.53,47.75 26.8,47.75 27.18,48.13 28.83,48.13 30.61,49.91 31.37,49.91 33.66,52.2 38.48,52.2 39.24,52.96 46.99,52.96 48.64,54.61 52.7,54.61 v52.96,54.86
  Bottom 0.203: v52.83,50.55 53.47,51.18 53.47,52.45 52.2,53.72 52.2,54.86 | 52.2,54.86 52.2,60.71 53.59,62.1 55.12,62.1 55.75,61.47 59.94,61.47 v60.07,61.34 | v25.53,50.29 v25.53,47.75 | v52.96,54.86 52.2,54.86
AREF
  Top 0.254: U3.20 54.99,48.71 C14.1
CS_EN  (via drill 0.33)
  Top 0.203: Q24.C 20.24,39.84 v20.95,39.12 | v21.59,13.72 21.59,12.57 20.95,11.94 19.43,11.94 18.41,10.92 18.41,7.49 | 18.41,7.49 18.41,7.45 R31.1 | v31.75,7.87 R29.1 32.3,6.06 v33.02,5.33 32.77,5.59 | v18.92,7.49 18.41,7.49 | R42.1 54.74,6.22 v54.36,6.6
  Bottom 0.203: v20.95,39.12 21.21,38.86 21.21,36.92 R32.1 21.3,36.41 20.19,35.31 20.19,25.65 19.94,25.4 19.94,17.27 21.34,15.88 21.34,13.97 v21.59,13.72 | v31.75,7.87 19.3,7.87 v18.92,7.49 | v54.36,6.6 53.47,6.6 52.2,5.33 39.24,5.33 38.99,5.08 33.27,5.08 v33.02,5.33
CS_ICP1_10MA  (via drill 0.33)
  Top 0.203: Q29.C 31.75,21.46 v32,21.72 | R44.1 38.35,11.05 v38.1,11.3
  Bottom 0.203: v32,21.72 32.64,21.72 33.4,22.48 34.29,22.48 34.8,21.97 34.8,21.08 34.54,20.83 34.54,20.32 34.16,19.94 34.16,17.02 34.67,16.51 35.94,16.51 36.58,15.88 36.58,12.53 R40.1 37.08,12.32 v38.1,11.3
EN_LD1
  Bottom 0.203: R19.2 J12.8
ESD_NODE  (via drill 0.33)
  Top 0.203: R15.2 C9.1 10.54,23.75 7.37,20.57 5.97,20.57 4.57,19.18 v4.06,19.18 | Q9.C 2.46,10.24 v2.41,10.29 | Q12.C v28.83,5.59 | Q16.C v6.35,5.71 | Q17.C v10.16,5.71 | Q7.C v21.46,5.59 | Q11.C v25.15,5.59
  Bottom 0.203: v4.06,19.18 3.17,19.18 2.41,18.41 v2.41,10.29 2.41,9.65 v6.35,5.71 7.11,4.95 10.16,4.95 | 10.16,4.95 15.11,4.95 15.75,5.59 v21.46,5.59 v25.15,5.59 v28.83,5.59 | v10.16,5.71 10.16,4.95
IO2  (via drill 0.33)
  Top 0.203: v43.18,43.18 43.69,43.69 43.69,44.04 U3.32 43.16,45.21 v42.93,45.21 | R7.1 31.15,60.16 v32.13,59.18 | Q6.1(G) 28.13,53.78 v26.54,55.37 | v38.48,47.62 37.97,48.13 36.07,48.13 34.8,46.86 v34.67,46.86
  Bottom 0.203: J9.5 52.7,13.34 49.66,13.34 49.02,12.7 43.94,12.7 43.31,12.06 41.78,12.06 41.66,12.19 40.01,12.19 39.5,12.7 39.5,13.46 40.01,13.97 40.01,16.26 39.37,16.89 39.37,23.24 36.32,26.29 36.32,32.77 40.13,36.58 40.13,41.02 42.29,43.18 v43.18,43.18 | v42.93,45.21 43.05,45.34 43.05,47.75 42.67,48.13 39.24,48.13 38.73,47.62 v38.48,47.62 | v32.13,59.18 32.13,57.11 R9.1 30.48,55.46 R8.2 | v26.54,55.37 28.11,55.37 R8.2 | v34.67,46.86 34.54,46.86 33.78,47.62 33.78,48.39 34.16,48.77 34.16,51.31 33.4,52.07 28.32,52.07 28.19,52.2 R8.1 R8.2
IO3  (via drill 0.33)
  Top 0.203: 43.98,42.25 43.51,41.78 42.93,41.78 42.67,42.04 v42.55,42.04 | v40.39,13.08 33.23,13.08 R22.2
  Top 0.254: U3.1 43.98,42.25
  Bottom 0.203: J9.6 50.8,13.97 49.28,13.97 48.64,13.34 43.56,13.34 43.05,12.83 42.04,12.83 41.78,13.08 v40.39,13.08 40.64,13.34 40.64,16.76 40.13,17.27 40.13,23.62 37.08,26.67 37.08,32.51 40.89,36.32 40.89,40.64 41.78,41.53 42.04,41.53 v42.55,42.04
IO3_
  Top 0.203: Q15.3(D) 30.1,5.97 29.78,5.65 Q12.E | Q12.B Q12.E | Q12.E 29.78,2.85 J2.3
IO4  (via drill 0.33)
  Top 0.203: U3.2 43.91,41.02 42.67,41.02 42.16,40.51 v42.04,40.51 | v41.15,23.5 41.27,23.37 47.24,23.37 v47.5,23.62 | v42.67,13.72 42.42,13.97 40.01,13.97 39.75,13.72 32.89,13.72 32.26,13.08 29.3,13.08 R21.2
  Bottom 0.203: v42.67,13.72 42.93,13.97 48.26,13.97 J9.7 48.64,16.13 48.13,16.13 47.12,17.14 47.12,23.24 v47.5,23.62 | v42.04,40.51 41.66,40.13 41.66,35.94 37.97,32.26 37.97,26.8 40.89,23.88 40.89,23.75 v41.15,23.5
IO4_
  Top 0.203: Q11.E 26.1,5.65 26.42,5.97 Q14.3(D) | Q11.B Q11.E | Q11.E 26.1,3.03 J2.4
IO5  (via drill 0.33)
  Top 0.203: U3.9 50.8,37.57 v50.8,36.83 | J12.7 29.84,34.67 31.5,33.02 39.12,33.02 41.02,31.11 41.02,29.59 42.93,27.69 44.2,27.69 45.34,26.54 46.35,26.54 v46.74,26.92 50.93,26.92 v51.05,26.8 51.69,26.8 52.2,27.3 R38.2
  Bottom 0.203: v50.8,36.83 52.32,35.31 52.32,32.51 51.05,31.24 v51.05,26.8 | J9.8 46.99,16.26 46.48,16.76 46.48,26.67 v46.74,26.92
IO6  (via drill 0.33)
  Top 0.203: U3.10 51.94,37.56 v51.94,36.96 | v51.82,25.91 50.67,25.91 50.29,26.29 47.37,26.29 46.99,25.91 44.96,25.91 44.07,26.8 v43.81,26.8 43.31,26.8 43.05,27.05 42.67,27.05 40.39,29.34 40.39,30.86 38.86,32.38 31.24,32.38 30.23,33.4 29.08,33.4 28.7,33.02 J12.9 | R46.2 55.12,12.7 53.34,14.48 53.34,15.88 52.58,16.64 51.82,16.64 51.18,17.27 48.9,17.27 48.13,16.51 46.61,16.51 46.1,17.02 45.34,17.02 44.45,16.13 J9.9
  Bottom 0.203: J9.9 44.45,16.13 45.09,16.76 45.09,26.29 44.58,26.8 v43.81,26.8 | v51.94,36.96 52.96,35.94 52.96,32.26 51.69,30.99 51.69,27.56 52.07,27.18 52.07,26.16 v51.82,25.91
IO7  (via drill 0.33)
  Top 0.203: U3.11 53.09,37.55 v53.09,37.08 | v52.58,29.84 51.05,28.32 v44.83,28.32 43.18,28.32 41.66,29.84 41.66,31.37 39.37,33.66 31.75,33.66 29.46,35.94 27.43,35.94 J12.6 R30.1
  Bottom 0.203: 53.09,36.96 53.59,36.45 53.59,32 52.58,30.99 v52.58,29.84 | J9.10 43.18,16.51 43.81,16.51 44.45,17.14 44.45,25.02 42.93,26.54 42.93,27.18 43.43,27.69 44.2,27.69 v44.83,28.32
  Bottom 0.254: v53.09,37.08 53.09,36.96
IO8  (via drill 0.33)
  Top 0.203: J10.10 40.01,15.24 41.27,16.51 42.55,16.51 43.18,15.88 43.18,14.61 44.45,13.34 | v53.34,28.96 52.7,28.96 51.44,27.69 45.97,27.69 v45.72,27.43 | v45.72,16.13 45.72,13.93 R49.2 | U3.12 54.23,37.53 v54.23,37.34 54.52,37.05 R50.2
  Top 0.254: 44.45,13.34 44.54,13.34 R49.2
  Bottom 0.203: v45.72,27.43 v45.72,16.13 | v54.23,37.34 54.23,31.75 53.47,30.99 53.47,29.08 v53.34,28.96
IO9  (via drill 0.33)
  Top 0.203: U3.13 55.37,37.52 v55.37,37.21 | v54.74,21.59 54.48,21.34 34.16,21.34 v33.91,21.59 33.91,22.19 R39.1
  Bottom 0.203: v55.37,37.21 54.86,36.7 54.86,31.37 54.23,30.73 54.23,22.1 v54.74,21.59 | J10.9 34.67,15.88 34.16,15.88 33.53,16.51 33.53,20.19 33.91,20.57 v33.91,21.59
IO10_
  Top 0.203: Q8.3(D) 22.86,6.22 22.41,5.78 Q7.E | Q7.B Q7.E | Q7.E 22.41,3.21 J2.5
IO11_
  Top 0.203: J1.3 9.21,3.09 Q17.B Q17.E 11.11,6.54 11.56,6.99 Q20.3(D)
IO12_
  Top 0.203: Q19.3(D) 7.75,6.22 7.3,5.78 Q16.E | Q16.E Q16.B | J1.4 6.14,2.71 7.3,3.87 Q16.E
IO13_
  Top 0.203: Q10.3(D) 2.58,11.64 4,10.22 Q9.E Q9.B 4.66,7.66 5.08,7.24 5.08,5.97 4.57,5.46 4.57,4.6 J1.5
MISO  (via drill 0.33)
  Top 0.203: U3.16 58.29,38 58.29,37.08 J11.1 | v29.46,18.41 30.86,18.41 31.11,18.67 58.55,18.67 58.8,18.41 v59.69,18.41 | R24.2 7.45,12.87 8.76,11.56 v10.92,11.56
  Bottom 0.203: v29.46,18.41 29.46,17.02 J10.6 26.54,15.24 26.42,15.11 26.42,14.73 25.65,13.97 24.13,13.97 22.35,12.19 14.61,12.19 13.97,11.56 v10.92,11.56 | v59.69,18.41 59.69,19.05 59.94,19.3 60.45,19.3 60.96,19.81 60.96,20.57 60.71,20.83 60.71,21.46 59.05,23.11 59.05,23.88 56.77,26.16 56.77,28.57 57.4,29.21 57.4,32.26 59.82,34.67 J11.1
MOSI  (via drill 0.33)
  Top 0.203: U3.15 57.53,37.63 57.53,36.83 58.04,36.32 v58.04,36.07 | v61.34,18.92 60.96,19.3 v30.35,19.3 | v57.02,33.27 57.28,33.02 57.28,28.7 v57.78,28.19 | J10.7 28.96,16.51 27.43,16.51 26.92,17.02 R25.2
  Bottom 0.203: v30.35,19.3 30.35,15.37 J10.7 | J11.4 62.1,38.1 60.83,36.83 58.8,36.83 v58.04,36.07 56.77,34.8 56.77,33.4 v57.02,33.27 | v61.34,18.92 61.34,19.3 61.59,19.56 61.59,20.7 61.34,20.95 61.34,21.72 59.69,23.37 59.69,24.26 57.53,26.42 57.53,27.94 v57.78,28.19
N$1
  Top 0.203: Q19.2(S) 6.8,10.73 5.97,11.56 5.97,13.42 R24.1
N$2
  Top 0.203: R6.2 43.14,60.59 Q5.1(G) 43.86,59.77 44.96,58.67 44.96,57.53 44.32,56.9 41.66,56.9 41.53,56.77 35.14,56.77 R10.1
N$3
  Top 0.203: R17.1 2.69,16.38 2.69,16.36 4.06,14.99 4.45,14.99 4.78,14.65 Q10.2(S)
N$4
  Top 0.203: R10.2 30.48,55.24 30.23,55.5 29.17,55.5 Q6.3(D)
N$5
  Top 0.203: R13.2 11.01,46.39 11.56,45.85 14.22,45.85 14.48,46.1 14.48,46.89 Q2.B
  Top 0.61: Q2.B 14.52,46.95 13.59,47.88 Q4.C
N$6
  Top 0.203: Q4.E 14.54,50.23 14.48,50.29 14.48,51.56 14.1,51.94 11.01,51.94 R1.2 10.79,52.83 10.1,53.53 Q3.B 10.16,54.21 10.16,54.99 11.05,55.88 Q3.C 11.05,56.9 11.89,57.74 Q1.1(G)
N$7
  Top 0.203: Q2.C 14.01,44.75 15.62,46.35 15.62,47.37 16,47.75 D1.A
N$8
  Top 0.203: R5.2 22.82,57.37 22.61,57.15 20.95,57.15 20.51,57.6 U1.1
N$9
  Top 0.203: Q25.B 14.42,11.78 R23.1
  Top 0.61: Q18.E 13.91,7.41 Q25.B
N$10
  Top 0.203: R1.1 12.03,50.2 12.64,49.59 Q4.B
  Top 0.61: Q2.E Q4.B
N$11
  Top 0.203: Q18.B 16.46,5.93 R31.2
  Top 0.61: Q25.C 15.37,6.37 Q18.B
N$12
  Top 0.203: Q20.2(S) 12.81,12.19 13.21,12.19 14.22,13.21 17.4,13.21 18.8,14.61 18.8,16.13 19.68,17.02 R25.1
N$13
  Bottom 0.203: R18.2 J12.10
N$14
  Top 0.203: J12.2 R14.2
N$15
  Top 0.203: J12.1 R12.1
N$16
  Top 0.203: J12.3 31.33,39.75 R11.1
N$17
  Top 0.203: R39.2 29.97,22.99 29.4,22.41 Q29.B
N$18
  Top 0.203: Q24.B 22.44,37.26 R30.2
N$19  (via drill 0.33)
  Top 0.203: Q34.C 58.72,10.71 58.93,10.92 58.93,11.05 60.2,12.32 | 60.2,12.32 60.54,12.66 R36.1 | v60.07,12.45 60.2,12.32
  Bottom 0.203: R45.1 60.11,12.41 v60.07,12.45
N$20
  Top 0.203: R26.1 68.78,7.58 Q21.E
  Top 0.61: Q21.E Q22.B
N$21  (via drill 0.33)
  Top 0.203: v69.47,12.45 68.8,11.77 R27.1 67.69,12.32 67.94,12.57 Q28.C
  Bottom 0.203: R37.1 69.34,12.32 v69.47,12.45
N$22  (via drill 0.33)
  Top 0.203: Q28.B 68.89,16.96 68.2,17.65 68.2,18.8 65.15,21.84 62.61,21.84 v62.36,21.59 | v58.8,26.54 55.59,26.54 R38.1
  Bottom 0.203: v62.36,21.59 60.33,23.62 60.33,24.51 58.8,26.04 v58.8,26.54
N$23
  Top 0.203: R27.2 67.82,9.91 69.09,11.18 70.48,11.18
  Top 0.254: 71.37,8.4 Q21.B 71.44,8.32
  Top 0.61: 71.44,8.32 70.48,9.27 70.48,11.18 Q22.C
N$24
  Top 0.203: J4.2 66.97,2.67 R33.2
N$25
  Top 0.203: R46.1 56.43,10.07 57.02,10.67 57.02,11.56 57.28,11.81 58.55,11.81 58.86,12.13 Q34.B
N$27
  Top 0.203: J4.4 60.54,2.67 R34.2
N$28
  Top 0.203: R35.1 57.24,6.64 57.32,6.56 Q26.E
  Top 0.61: Q26.E 58.04,6.6 58.99,7.56 Q27.B
N$29
  Top 0.203: R36.2 61.13,10.71 60.66,10.24 Q27.C
  Top 0.61: Q27.C 59.94,6.62 Q26.B
N$91
  Top 0.203: Q23.B 34.1,11.66 R20.1
  Top 0.61: Q13.E Q23.B
N$93
  Top 0.203: Q14.2(S) 25.47,11.2 R21.1
N$97
  Top 0.203: Q13.B 35.94,5.99 35.94,5.33 35.56,4.95 34.04,4.95 33.19,4.1 R29.2
  Top 0.61: Q23.C 35.05,7 Q13.B
N$104
  Top 0.203: R16.1 20.59,8.55 Q8.2(S)
N$107
  Top 0.203: R48.2 48.86,10.36 Q35.B
N$108
  Top 0.203: R49.1 45.76,11.09 46.1,11.43 Q35.C
N$110
  Top 0.203: Q15.2(S) 29.15,10.95 R22.1
N$114
  Top 0.203: Q31.B 51.12,12.42
  Top 0.254: 51.12,12.42 R41.1
  Top 0.61: Q30.E Q31.B
N$115
  Top 0.203: U3.7 46.74,38.19 46.74,35.56 45.97,34.8 45.34,34.8 44.11,33.57 | C15.2 43.69,31.24 44.32,31.88 44.32,33.32 Y1.1
  Top 0.254: 44.11,33.57 Y1.1
N$116
  Top 0.203: 48.64,30.61 49.66,31.62 49.66,33.48 | 49.61,33.7 48.51,34.8 48.13,34.8 47.37,35.56 47.37,37.7 U3.8
  Top 0.254: C16.2 48.64,30.61 | 49.66,33.48 Y1.2 49.61,33.7
N$119
  Top 0.203: R42.2 54.06,3.34 53.02,4.38 Q30.B
  Top 0.61: Q31.C 52.07,7.89 Q30.B
N$122
  Top 0.203: R43.1 42.51,8.82 Q33.B
  Top 0.61: Q32.E Q33.B
N$123
  Top 0.203: Q32.B 40.05,10.58 39.75,10.29 39.75,9.44 R44.2
  Top 0.61: Q33.C 41.53,9.63 Q32.B
PL  (via drill 0.33)
  Top 0.203: J3.2 47.2,2.76 R47.2 47.2,6.3 R48.1 46.23,6.99 45.97,7.24 v45.47,7.24 | Q32.C 41.83,12.78 43.43,11.18 v43.43,7.24
  Bottom 0.203: v43.43,7.24 v45.47,7.24
POWER
  Top 1.016: J8.1 3.17,63.37 7.49,59.05 Q1.3(D)
RX  (via drill 0.33)
  Top 0.203: U3.30 43.77,46.86 42.29,46.86 v40.26,44.83 | v37.47,22.35 37.85,21.97 53.85,21.97 54.36,22.48 55.24,22.48 55.88,21.84 57.28,21.84 v58.29,20.83
  Bottom 0.203: v40.26,44.83 40.01,44.58 40.01,42.93 38.61,41.53 38.61,37.21 34.67,33.27 34.67,25.53 37.47,22.73 v37.47,22.35 | v58.29,20.83 58.04,20.57 58.04,16.26 58.42,15.88 58.42,15.37 58.55,15.24 J9.3
SCK  (via drill 0.33)
  Top 0.203: v60.07,20.19 59.82,19.94 31.11,19.94 30.86,20.19 29.72,20.19 v29.08,19.56 | U3.17 54.36,44.04 54.36,43.05 58.42,38.99 58.93,38.99 J11.3 | v22.86,19.05 6.6,19.05 4.57,17.02 R17.2
  Bottom 0.203: J11.3 58.67,38.1 57.15,36.58 57.15,36.45 56.13,35.43 56.13,30.99 56.64,30.48 56.64,29.59 56.13,29.08 56.13,25.78 58.42,23.5 58.42,22.86 60.07,21.21 v60.07,20.19 | v29.08,19.56 28.32,18.8 28.32,17.14 27.81,16.64 26.54,16.64 J10.5 22.86,17.53 v22.86,19.05
SCL  (via drill 0.33)
  Top 0.203: U3.28 44.96,47.94 44.96,48.13 44.32,48.77 43.56,48.77 42.42,47.62 41.78,47.62 35.94,41.78 35.05,41.78 34.67,41.4 v34.04,41.4 | v32.38,29.59 32.13,29.34 29.84,29.34 29.21,28.7 20.83,28.7 20.19,29.34 16.26,29.34 v16,29.08 | v16,37.08 J13.1
  Bottom 0.203: v34.04,41.4 32.64,40.01 32.64,29.84 v32.38,29.59 | J10.1 14.99,21.21 15.75,21.97 15.75,28.83 v16,29.08 v16,37.08
SCL1  (via drill 0.33)
  Top 0.203: v55.75,29.97 55.75,32 51.82,35.94 50.42,35.94 49.78,36.58 49.78,37.34 49.02,38.1 49.02,39.12 48.13,40.01 47.42,40.01 U3.6 46.1,38.69 46.1,38.1 45.47,37.47 v45.47,37.34 | v41.02,26.16 39.88,25.02 v20.83,25.02
  Bottom 0.203: v55.75,29.97 55.5,29.72 55.5,25.4 57.78,23.11 57.78,22.61 59.18,21.21 59.18,20.45 58.8,20.07 58.8,16.76 59.05,16.51 60.2,16.51 60.96,15.75 60.96,15.49 61.21,15.24 J9.2 | v45.47,37.34 43.69,37.34 43.05,36.7 43.05,35.31 40.64,32.89 40.64,26.54 v41.02,26.16 | v20.83,25.02 20.83,33.27 22.23,34.67 R19.1
SDA  (via drill 0.33)
  Top 0.203: U3.27 44.62,49.4 43.31,49.4 42.16,48.26 41.53,48.26 35.69,42.42 v34.42,42.42 | v32.51,27.81 31.88,27.18 v17.53,27.18 | J13.2 10.7,39.08 11.81,37.97 15.49,37.97 15.75,38.23 v17.53,38.23
  Bottom 0.203: v34.42,42.42 34.92,41.91 34.92,41.15 33.4,39.62 33.4,28.7 v32.51,27.81 | J10.2 17.53,16.26 17.78,16.51 17.78,26.92 v17.53,27.18 v17.53,38.23
SDA1  (via drill 0.33)
  Top 0.203: U3.3 44.15,40.13 v43.18,40.13 | v42.04,24.26 42.16,24.13 46.74,24.13 47.12,24.51 47.88,24.51 49.02,23.37 53.09,23.37 53.72,24 55.63,24 56.01,23.62 57.28,23.62 57.78,23.11 57.78,22.61 59.31,21.08 60.45,21.08 62.36,19.18 v64.52,19.18 | v23.5,30.73 29.21,30.73 30.23,31.75 38.23,31.75 v38.99,30.99
  Bottom 0.203: v43.18,40.13 42.42,39.37 42.42,35.56 38.73,31.88 38.73,30.99 | 38.73,30.99 38.73,27.3 41.78,24.26 v42.04,24.26 | v64.52,19.18 64.77,19.18 J9.1 | v38.99,30.99 38.73,30.99 | R18.1 22.39,31.84 v23.5,30.73
SHLD_VIN
  Top 1.016: Q5.3(D) 46.06,59.99 44.7,61.34 44.7,62.36 43.56,63.5 J6.1
TX  (via drill 0.33)
  Top 0.203: U3.31 43.53,45.97 43.31,45.97 43.18,46.1 42.55,46.1 42.04,45.59 42.04,45.34 40.89,44.2 v40.89,43.81 | v38.48,22.86 38.73,22.61 53.34,22.61 53.98,23.24 55.37,23.24 55.88,22.73 v56.9,22.73
  Bottom 0.203: v40.89,43.81 40.77,43.69 40.77,42.8 39.37,41.4 39.37,36.96 35.43,33.02 35.43,25.91 v38.48,22.86 | J9.4 57.15,16.13 57.4,16.51 57.4,22.23 v56.9,22.73
VIN  (via drill 0.33, 0.41)
  Top 0.203: R6.1 41.19,60.16 U2.1 | U1.4 18.61,54.68 v18.29,54.36 | 17.78,60.83 17.78,60.71 v18.16,60.33 | Q31.E 53.02,10.6 v53.21,10.79 53.02,10.92 53.02,12.42 53.05,12.45 R41.2 | Q33.E 40.58,7.94 v40.26,7.62 40.55,7.33 R43.2 | R35.2 57.32,8.6 v57.78,8.13 | Q27.E 60.89,8.82 v61.34,9.27 | Q23.E 36,8.82 v36.2,9.02 36.03,9.18 R20.2 | Q25.E 16.32,9.71 v16.51,9.91 16.34,10.07 16.34,11.64 16.38,11.68 R23.2 | R15.1 13.55,27.9 v14.22,28.57 | R26.2 67.98,5.63 v69.09,6.73 | 71.44,10.23 71.44,11.24 v71.63,11.43
  Top 0.254: Q22.E 71.44,10.23
  Top 0.406: 23.5,60.83 v23.5,59.56
  Top 1.016: R4.1 17.02,60.07 17.78,60.83 23.5,60.83 25.27,60.83 26.54,59.56 26.54,59.18 28.7,57.02 33.91,57.02 34.67,57.78 41.02,57.78 41.78,58.55 | U2.1 41.91,58.67 41.78,58.55 | Q5.2(S) 41.78,57.98 41.78,58.55
  Bottom 0.203: v18.29,54.36 18.54,54.61 18.54,59.94 v18.16,60.33 | v53.21,10.79 53.21,10.54 | v40.26,7.62 40.26,9.27 | v57.78,8.13 57.78,10.54 | v61.34,9.27 60.33,8.26 | v36.2,9.02 36.2,9.27 | v14.22,28.57 13.84,28.57 | v71.63,11.43 71.63,7.75 70.61,6.73 v69.09,6.73
  Bottom 0.406: v69.09,6.73 61.85,6.73 60.33,8.26 58.04,10.54 57.78,10.54 53.21,10.54 45.59,10.54 44.32,9.27 40.26,9.27 36.2,9.27 35.43,9.27 34.16,10.54 17.14,10.54 v16.51,9.91 8.38,9.91 7.49,10.79 7.49,16.51 13.84,22.86 13.84,28.57 13.84,39.12 23.5,48.77 v23.5,59.56
VIN_S  (via drill 0.33)
  Top 0.203: U1.3 18.32,58.2 v17.65,57.53 | v16,56.9 15.6,56.49 | R2.2 19.09,52.28 v19.68,51.69 | Q3.E 12,54.42 13.21,55.63 13.21,56.52 C1.1
  Top 1.016: Q1.2(S) 13.77,60.01 | 13.77,60.01 R4.2 | 13.77,60.01 13.77,57.48 C1.1 14.82,57.28 15.6,56.49 15.64,56.49 16.13,56.01 C2.1
  Bottom 0.203: v16,56.9 16.64,57.53 v17.65,57.53 17.91,57.28 17.91,55.24 17.4,54.74 17.4,53.98 v19.68,51.69

### Text on the board
tPlace: RPUno | RPUBUS.ORG
bPlace: PWR / 7..36V | NC | IOREF | nRST | NC | 5V | 0V | 0V | ADC6 | ADC7 | 0V | NC | VIN | ADC0 | ADC1 | ADC2 | ADC3 | NC | NC | 0V | 0V | 5V | SHIELD VIN IS / CNTRLD BY D2 (IO2) | 0V | 5V | SPI | ADC3 | ADC2 | ADC1 | 0V | !RESET | 0V | MOSI | +5V | SCK | 7 | 5 | MISO | IOREF | SCL | *E1 | SDA | 6 | *E0 | RX | SCL | SDA | NC | 0V | B5 | B4 | B3 | !SS | B1 | ICP1 | D7 | D6 | D5 | D4 | D3 | D2 | TX | +5V (*E1) | 0V (*E0) | SCL | SDA | NC | 0V | 13 | 12 | 11 | 10 | 9 | 8 | 7 | 6 | 5 | 4 | 3 | 2 | 1 | 0 | DIGITAL | ICP1 | ANALOG | DIGITAL | 14140^8 | RPUno | RPUBUS.ORG | 13 | 12 | 11 | 10 | PL | 17mA | 22mA | ADC1 | 0V | ADC0 | 22mA | 22mA | 0V | 4 | 3 | 22mA | 0V | 0V